# EAGLE design YARO (EAGLE 6.6.0)
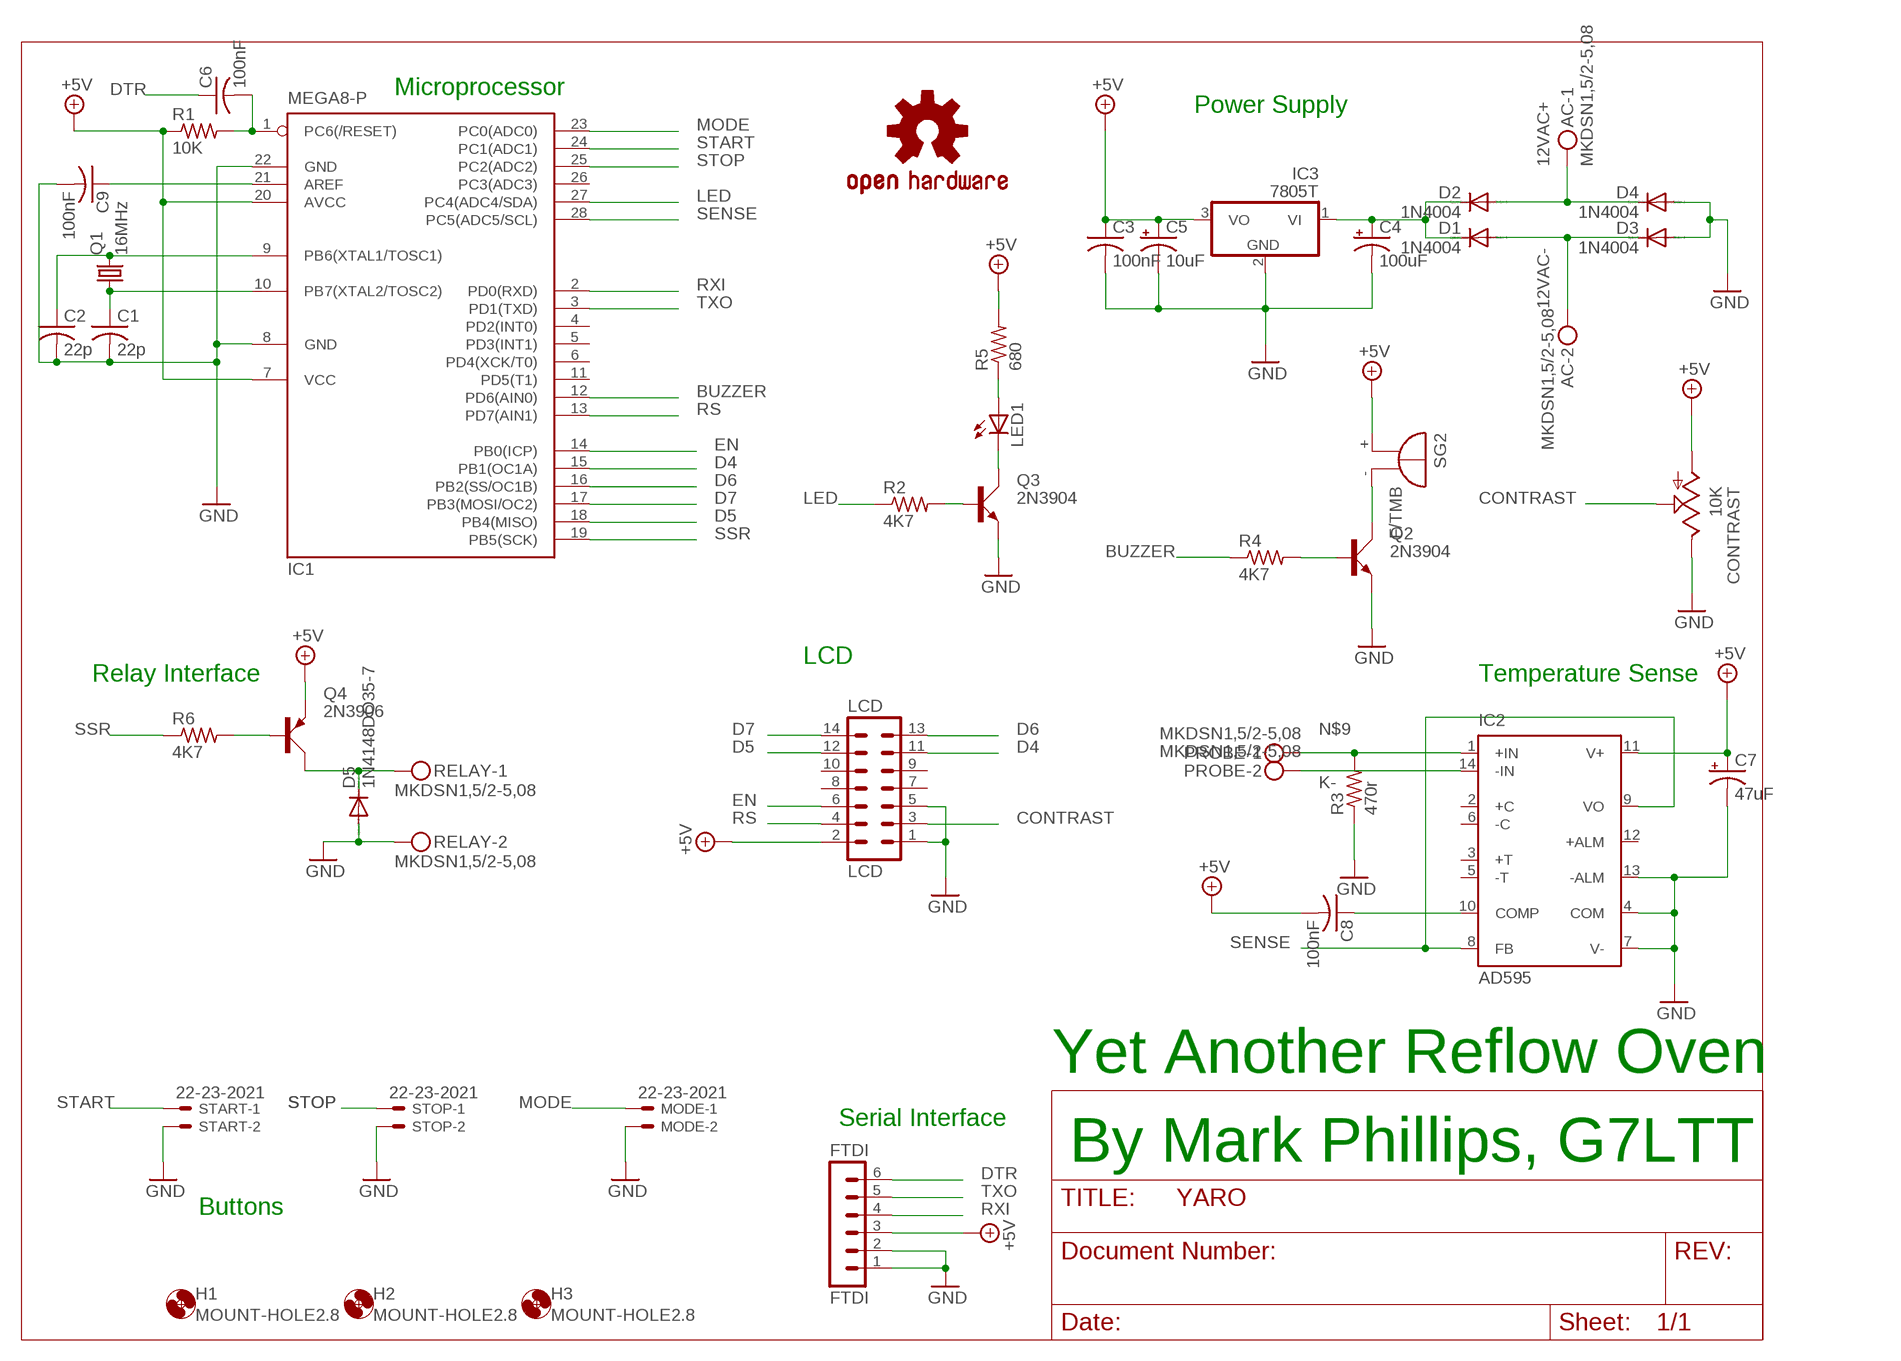
[diagram p0: schematic, sheet 1]

## Parts
AC  MKDSN1,5/2-5,08  [MKDSN1,5/2-5,08]
C1  22p  C-US025-025X050  [C025-025X050]
C2  22p  C-US025-025X050  [C025-025X050]
C3  100nF  C-US025-025X050  [C025-025X050]
C4  100uF  CPOL-USE2.5-6  [E2,5-6]
C5  10uF  CPOL-USE2.5-5  [E2,5-5]
C6  100nF  C-US025-025X050  [C025-025X050]
C7  47uF  CPOL-USE2.5-5  [E2,5-5]
C8  100nF  C-US025-025X050  [C025-025X050]
C9  100nF  C-US025-025X050  [C025-025X050]
CONTRAST  10K  TRIM_US-CA6V  [CA6V]
D1  1N4004  [DO41-10]
D2  1N4004  [DO41-10]
D3  1N4004  [DO41-10]
D4  1N4004  [DO41-10]
D5  1N4148DO35-7  [DO35-7]
FTDI  FTDI  MA06-1  [MA06-1]
H1  MOUNT-HOLE2.8  [2,8]
H2  MOUNT-HOLE2.8  [2,8]
H3  MOUNT-HOLE2.8  [2,8]
IC1  MEGA8-P  [DIL28-3]
IC2  AD595  [DIL14]
IC3  7805T  [TO220H]
LCD  LCD  MA07-2  [MA07-2]
LED1  LED5MM  [LED5MM]
LOGO2  OSHW-LOGOL  [OSHW-LOGO-L]
MODE  22-23-2021  [22-23-2021]
PROBE  MKDSN1,5/2-5,08  [MKDSN1,5/2-5,08]
Q1  16MHz  CRYSTALHC49S  [HC49/S]
Q2  2N3904  [TO92D]
Q3  2N3904  [TO92D]
Q4  2N3906  [TO92D]
R1  10K  R-US_0204/7  [0204/7]
R2  4K7  R-US_0204/7  [0204/7]
R3  470r  R-US_0204/7  [0204/7]
R4  4K7  R-US_0204/7  [0204/7]
R5  680  R-US_0204/7  [0204/7]
R6  4K7  R-US_0204/7  [0204/7]
RELAY  MKDSN1,5/2-5,08  [MKDSN1,5/2-5,08]
SG2  F/TMB  [F/TMB]
START  22-23-2021  [22-23-2021]
STOP  22-23-2021  [22-23-2021]

## Nets
12VAC+: AC.1 D2.A D4.C
12VAC-: AC.2 D1.A D3.C
+5V: C3.1 C5.+ C7.+ C8.2 CONTRAST.A FTDI.3 IC1.7(VCC) IC1.20(AVCC) IC2.11(V+) IC3.3(VO) LCD.2 Q4.E R1.1 R5.2 SG2.+
BUZZER: IC1.12(PD6(AIN0)) R4.1
CONTRAST: CONTRAST.S LCD.3
D4: IC1.15(PB1(OC1A)) LCD.11
D5: IC1.18(PB4(MISO)) LCD.12
D6: IC1.16(PB2(SS/OC1B)) LCD.13
D7: IC1.17(PB3(MOSI/OC2)) LCD.14
DTR: C6.1 FTDI.6
EN: IC1.14(PB0(ICP)) LCD.6
GND: C1.2 C2.2 C3.2 C4.- C5.- C7.- C9.2 CONTRAST.E D3.A D4.A D5.A FTDI.1 FTDI.2 IC1.8(GND) IC1.22(GND) IC2.4(COM) IC2.7(V-) IC2.13(-ALM) IC3.2(GND) LCD.1 LCD.5 MODE.2 Q2.E Q3.E R3.1 RELAY.2 START.2 STOP.2
K-: IC2.14(-IN) PROBE.2
LED: IC1.27(PC4(ADC4/SDA)) R2.1
MODE: IC1.23(PC0(ADC0)) MODE.1
N$1: C2.1 IC1.9(PB6(XTAL1/TOSC1)) Q1.2
N$2: C1.1 IC1.10(PB7(XTAL2/TOSC2)) Q1.1
N$3: C4.+ D1.C D2.C IC3.1(VI)
N$4: C6.2 IC1.1(PC6(/RESET)) R1.2
N$5: Q3.B R2.2
N$6: LED1.K(C) Q3.C
N$7: Q4.B R6.2
N$8: D5.C Q4.C RELAY.1
N$9: IC2.1(+IN) PROBE.1 R3.2
N$10: C9.1 IC1.21(AREF)
N$11: C8.1 IC2.10(COMP)
N$12: Q2.C SG2.-
N$13: Q2.B R4.2
N$18: LED1.A R5.1
RS: IC1.13(PD7(AIN1)) LCD.4
RXI: FTDI.4 IC1.2(PD0(RXD))
SENSE: IC1.28(PC5(ADC5/SCL)) IC2.8(FB) IC2.9(VO)
SSR: IC1.19(PB5(SCK)) R6.1
START: IC1.24(PC1(ADC1)) START.1
STOP: IC1.25(PC2(ADC2)) STOP.1
TXO: FTDI.5 IC1.3(PD1(TXD))
Unconnected: IC1.4(PD2(INT0)) IC1.5(PD3(INT1)) IC1.6(PD4(XCK/T0)) IC1.11(PD5(T1)) IC1.26(PC3(ADC3)) IC2.2(+C) IC2.3(+T) IC2.5(-T) IC2.6(-C) IC2.12(+ALM) LCD.7 LCD.8 LCD.9 LCD.10

## Notes on the sheet
- Microprocessor
- Power Supply
- LCD
- Relay Interface | Temperature Sense
- Yet Another Reflow Oven
- Serial Interface
- By Mark Phillips, G7LTT
- Buttons

## Library data of the parts
AC PROBE RELAY = con-phoenix-508:MKDSN1,5/2-5,08: MKDSN 1,5/ 2-5,08 Printklemme Nennstrom: 13,5 A Nennspannung: 250 V Rastermaß: 5,08 mm Polzahl: 2 Anschlussart: Schraubanschluss Montage: Löten Anschlussrichtung Leiter/Platine: 0 ° Artikelnummer: 1729128 Source: http://eshop.phoenixcontact.com .. 1729128.pdf
C1-C3 C6 C8 C9 = rcl:C-US: CAPACITOR, American symbol
C4 C5 C7 = rcl:CPOL-US: POLARIZED CAPACITOR, American symbol
CONTRAST = pot:TRIM_US-: POTENTIOMETER
D1-D4 = diode:1N4004: DIODE general purpose rectifier, 1 A
D5 = diode:1N4148: DIODE high speed (Philips)
FTDI = con-lstb:MA06-1: PIN HEADER; OC_FARNELL: unknown; OC_NEWARK: unknown
H1-H3 = holes:MOUNT-HOLE: MOUNTING HOLE with drill center marker
IC1 = atmel:MEGA8-P: MICROCONTROLLER 8 Kbytes FLASH, 1 kbytes SRAM, 512 bytes EEPROM, USART, 4-channel 10 bit ADC, 2-channel 8 bit ADC Pin compatible with Atmega48, ATMega88, ATMega168 Source: avr.lbr; OC_FARNELL: unknown; OC_NEWARK: unknown
IC2 = analog-devices:AD595: ANALOG DEVICES; MPN: AD595AQ; OC_FARNELL: 409194; OC_NEWARK: 06WX1596
IC3 = linear:78*: Positive VOLTAGE REGULATOR Source: http://cache.national.com/ds/LM/LM78L05.pdf http://www.fairchildsemi.com/ds/LM/LM7805.pdf
LCD = con-lstb:MA07-2: PIN HEADER; OC_FARNELL: unknown; OC_NEWARK: unknown
LED1 = led:LED: LED OSRAM: - CHIPLED LG R971, LG N971, LY N971, LG Q971, LY Q971, LO R971, LY R971 LH N974, LH R974 LS Q976, LO Q976, LY Q976 LO Q996 - Hyper CHIPLED LW Q18S LB Q993, LB Q99A, LB R99A - SideLED LS A670, LO A670, LY A670, LG A670, LP A670 LB A673, LV A673, LT A673, LW A673 LH A674 LY A675 LS A676, LA A676, LO A676, LY A676, LW A676 LS A679, LY A679, LG A679 - Hyper Micro SIDELED® LS Y876, LA Y876, LO Y876, LY Y876 LT Y87S - SmartLED LW L88C, LW L88S LB L89C, LB L89S, LG L890 LS L89K, LO L89K, LY L89K LS L896, LA L896, LO L896, LY L896 - TOPLED LS T670, LO T670, LY T670, LG T670, LP T670 LSG T670, LSP T670, LSY T670, LOP T670, LYG T670 LG T671, LOG T671, LSG T671 LB T673, LV T673, LT T673, LW T673 LH T674 LS T676, LA T676, LO T676, LY T676, LB T676, LH T676, LSB T676, LW T676 LB T67C, LV T67C, LT T67C, LS T67K, LO T67K, LY T67K, LW E67C LS E67B, LA E67B, LO E67B, LY E67B, LB E67C, LV E67C, LT E67C LW T67C LS T679, LY T679, LG T679 LS T770, LO T770, LY T770, LG T770, LP T770 LB T773, LV T773, LT T773, LW T773 LH T774 LS E675, LA E675, LY E675, LS T675 LS T776, LA T776, LO T776, LY T776, LB T776 LHGB T686 LT T68C, LB T68C - Hyper Mini TOPLED® LB M676 - Mini TOPLED Santana® LG M470 LS M47K, LO M47K, LY M47K Source: http://www.osram.convergy.de LUXEON: - LUMILED® LXK2-PW12-R00, LXK2-PW12-S00, LXK2-PW14-U00, LXK2-PW14-V00 LXK2-PM12-R00, LXK2-PM12-S00, LXK2-PM14-U00 LXK2-PE12-Q00, LXK2-PE12-R00, LXK2-PE12-S00, LXK2-PE14-T00, LXK2-PE14-U00 LXK2-PB12-K00, LXK2-PB12-L00, LXK2-PB12-M00, LXK2-PB14-N00, LXK2-PB14-P00, LXK2-PB14-Q00 LXK2-PR12-L00, LXK2-PR12-M00, LXK2-PR14-Q00, LXK2-PR14-R00 LXK2-PD12-Q00, LXK2-PD12-R00, LXK2-PD12-S00 LXK2-PH12-R00, LXK2-PH12-S00 LXK2-PL12-P00, LXK2-PL12-Q00, LXK2-PL12-R00 Source: www.luxeon.com KINGBRIGHT: KA-3528ASYC Source: www.kingbright.com
LOGO2 = SparkFun-Aesthetics:OSHW-LOGO: Open Source Hardware Logo This logo indicates the piece of hardware it is found on incorporates a OSHW license and/or adheres to the definition of open source hardware found here: http://freedomdefined.org/OSHW
MODE START STOP = con-molex:22-23-2021: .100" (2.54mm) Center Header - 2 Pin; MF: MOLEX; MPN: 22-23-2021; OC_FARNELL: 1462926; OC_NEWARK: 25C3832
Q1 = crystal:CRYSTAL: CRYSTAL; OC_FARNELL: 1667008; OC_NEWARK: unknown
Q2 Q3 = transistor-small-signal:2N3904: NPN TRANSISTOR
Q4 = transistor-small-signal:2N3906: PNP TRANSISTOR
R1-R6 = resistor:R-US_: RESISTOR, American symbol
SG2 = buzzer:F/TMB: BUZZER Source: Buerklin; OC_FARNELL: unknown; OC_NEWARK: unknown

## Board
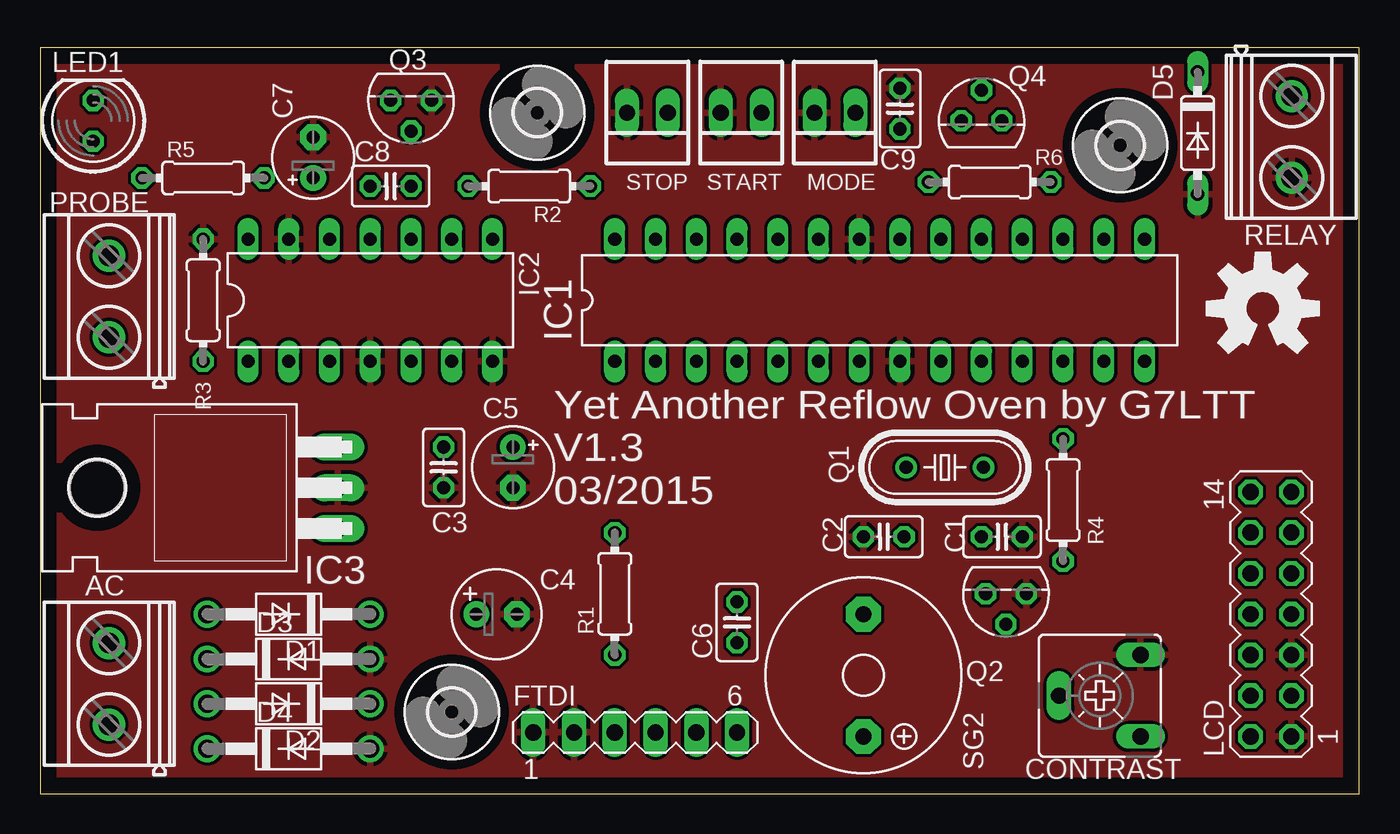
[diagram p1: board, top side]
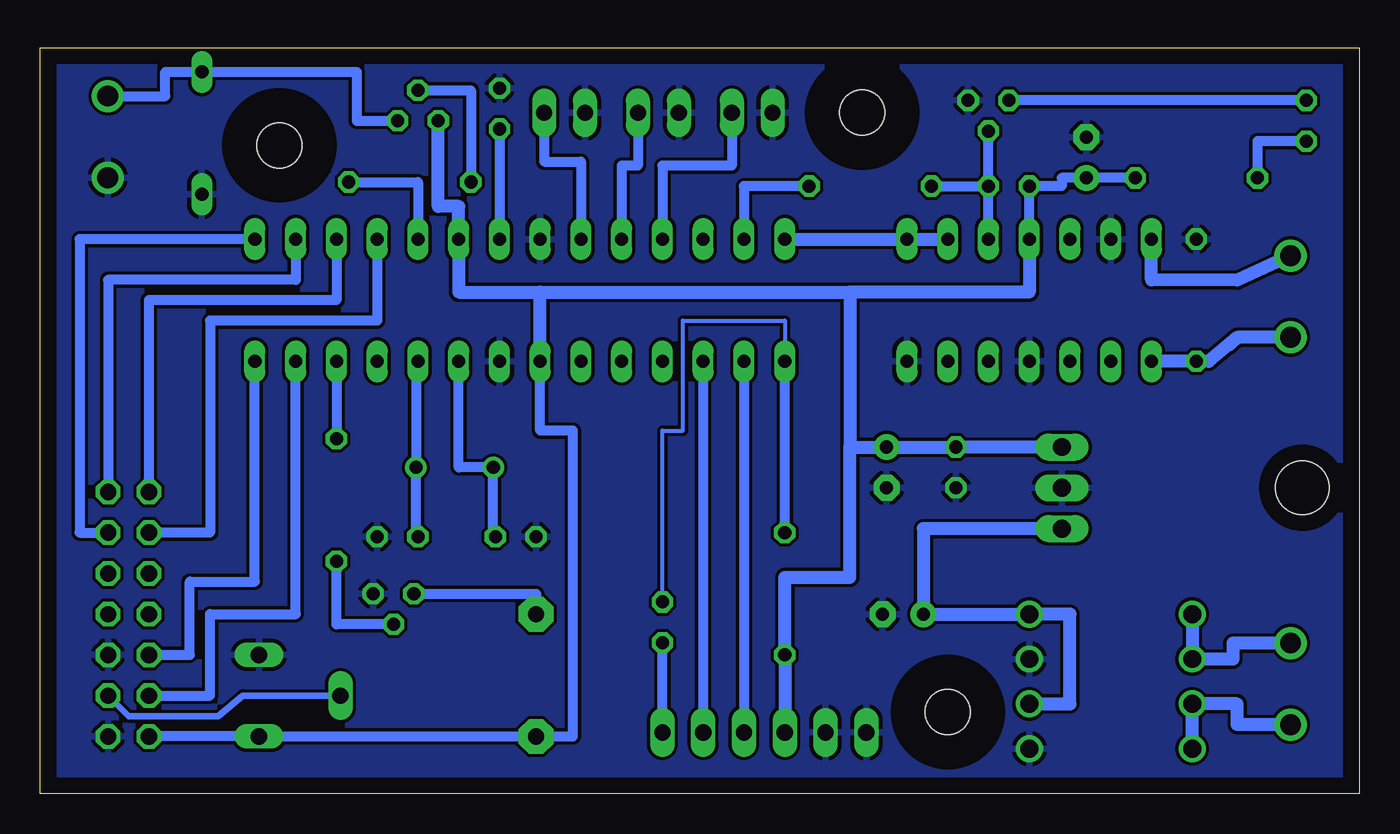
[diagram p2: board, bottom side, seen from below]

Size 82.22 x 46.47 mm. Coordinates in mm from the lower left corner, seen from the top.
Outline: 0,0 82.22,0 82.22,46.47 0,46.47 0,0
Copper layers (1*16): Top 0.035mm / dielectric 1.5mm / Bottom 0.035mm
Design rules "default": minimum track width 10mil, minimum drill 24mil, track to track 8mil, track to pad 8mil, pad to pad 8mil, via to via 8mil, smd to smd 8mil, copper to edge 40mil, drill to drill 8mil, minimum pad ring 10mil, minimum via ring 8mil, stop-mask expansion 4mil, vias tented up to drill 0mil, thermal gap 10mil

### Footprints (pad centres in the part's own frame; a part is rotated, then mirrored left to right if it is on the bottom)
MKDSN1,5/2-5,08 = drill 1.3 pad 2: 1 -2.561,0.025; 2 2.519,0.025
C025-025X050 = drill 0.813 octagon: 1 -1.27,0; 2 1.27,0
E2,5-6 = drill 0.813 pad 1.6: + -1.27,0 | drill 0.813 pad 1.6 octagon: - 1.27,0
E2,5-5 = drill 0.813 pad 1.6: + -1.27,0 | drill 0.813 pad 1.6 octagon: - 1.27,0
CA6V = drill 1.016 long: A -2.54,-2.54; E 2.54,-2.54; S 0,2.54
DO41-10 = drill 1.118: A 5.08,0; C -5.08,0
DO35-7 = drill 0.813 long: A 3.81,0; C -3.81,0
MA06-1 = drill 1.016 long: 1 -6.35,0; 2 -3.81,0; 3 -1.27,0; 4 1.27,0; 5 3.81,0; 6 6.35,0
2,8 = hole 2.8: 0,0
DIL28-3 = drill 0.813 long: 1 -16.51,-3.81; 2 -13.97,-3.81; 3 -11.43,-3.81; 4 -8.89,-3.81; 5 -6.35,-3.81; 6 -3.81,-3.81; 7 -1.27,-3.81; 8 1.27,-3.81; 9 3.81,-3.81; 10 6.35,-3.81; 11 8.89,-3.81; 12 11.43,-3.81; 13 13.97,-3.81; 14 16.51,-3.81; 15 16.51,3.81; 16 13.97,3.81; 17 11.43,3.81; 18 8.89,3.81; 19 6.35,3.81; 20 3.81,3.81; 21 1.27,3.81; 22 -1.27,3.81; 23 -3.81,3.81; 24 -6.35,3.81; 25 -8.89,3.81; 26 -11.43,3.81; 27 -13.97,3.81; 28 -16.51,3.81
DIL14 = drill 0.813 long: 1 -7.62,-3.81; 2 -5.08,-3.81; 3 -2.54,-3.81; 4 0,-3.81; 5 2.54,-3.81; 6 5.08,-3.81; 7 7.62,-3.81; 8 7.62,3.81; 9 5.08,3.81; 10 2.54,3.81; 11 0,3.81; 12 -2.54,3.81; 13 -5.08,3.81; 14 -7.62,3.81
TO220H = drill 1.118 long: 1 -2.54,-10.16; 2 0,-10.16; 3 2.54,-10.16 | hole 3.302: 0,4.826
MA07-2 = drill 1.016 octagon: 1 -7.62,-1.27; 2 -7.62,1.27; 3 -5.08,-1.27; 4 -5.08,1.27; 5 -2.54,-1.27; 6 -2.54,1.27; 7 0,-1.27; 8 0,1.27; 9 2.54,-1.27; 10 2.54,1.27; 11 5.08,-1.27; 12 5.08,1.27; 13 7.62,-1.27; 14 7.62,1.27
LED5MM = drill 0.813 octagon: A -1.27,0; K 1.27,0
22-23-2021 = drill 1 long: 1 -1.27,0; 2 1.27,0
HC49/S = drill 0.813: 1 -2.413,0; 2 2.413,0
TO92D = drill 0.813 octagon: B 0,1.905; C 1.27,0; E -1.27,0
0204/7 = drill 0.813 octagon: 1 -3.81,0; 2 3.81,0
F/TMB = drill 1.016 pad 2.159 octagon: + 3.81,0; - -3.81,0

### Placement (x,y rotation side)
AC  4.32,6.86 90 top
C1  59.94,16 0 top
C2  52.58,16 180 top
C3  25.15,20.32 270 top
C4  28.45,11.18 0 top
C5  29.46,20.32 270 top
C6  43.43,10.67 90 top
C7  17.02,39.62 90 top
C8  21.84,37.85 180 top
C9  53.59,42.67 90 top
CONTRAST  66.04,6.1 90 top
D1  15.49,11.18 180 top
D2  15.49,5.59 180 top
D3  15.49,8.38 0 top
D4  15.49,2.79 0 top
D5  72.14,41.15 270 top
FTDI  37.08,3.81 0 top
H1  30.99,42.42 0 top
H2  25.65,5.08 0 top
H3  67.31,40.39 0 top
IC1  52.32,30.73 0 top
IC2  20.57,30.73 0 top
IC3  8.38,19.05 90 top
LCD  76.71,11.18 90 top
LED1  3.3,41.91 90 top
LOGO2  76.2,30.23 0 top
MODE  49.53,42.42 180 top
PROBE  4.32,30.99 90 top
Q1  56.39,20.32 180 top
Q2  60.2,12.45 180 top
Q3  23.11,43.18 180 top
Q4  58.67,41.91 0 top
R1  35.81,12.45 90 top
R2  30.48,37.85 180 top
R3  10.16,30.73 270 top
R4  63.75,18.29 270 top
R5  10.16,38.35 0 top
R6  59.18,38.1 180 top
RELAY  77.98,40.89 270 top
SG2  51.31,7.37 270 top
START  43.69,42.42 180 top
STOP  37.85,42.42 180 top

### Tracks (layer width: path | path; a pad name or v marks a point on that pad's centre or on a via)
12VAC+
  Bottom 0.813: D4.C D2.A 7.62,5.59 7.62,4.3 AC.1
12VAC-
  Bottom 0.813: D1.A D3.C 7.87,8.38 7.87,9.38 AC.2
+5V
  Bottom 0.61: IC2.11 C8.2 18.54,37.85 18.54,38.35 C7.+ R5.2 | IC1.7 51.05,22.61 49.02,22.61 49.02,3.56 SG2.+ CONTRAST.A LCD.2
  Bottom 0.813: FTDI.3 R1.1 35.81,13.46 31.75,13.46 31.75,21.59 | IC3.3 C3.1 C5.+ 31.75,21.59 | IC2.11 20.57,31.24 31.75,31.24 | 31.75,31.24 31.75,21.59 | 51.05,31.24 56.13,31.24 IC1.20 56.13,36.58 57.4,36.58 Q4.E | 51.05,31.24 31.75,31.24 | IC1.7 51.05,31.24
BUZZER
  Bottom 0.61: IC1.12 R4.1
CONTRAST
  Bottom 0.406: LCD.3 76.71,4.83 71.12,4.83 69.6,6.1 CONTRAST.S
D4
  Bottom 0.61: IC1.15 79.76,34.54 79.76,16.26 LCD.11
D5
  Bottom 0.61: IC1.18 61.21,29.46 71.63,29.46 71.63,16.26 LCD.12
D6
  Bottom 0.61: IC1.16 66.29,32 77.98,32 LCD.13
D7
  Bottom 0.61: IC1.17 63.75,30.73 75.44,30.73 LCD.14
DTR
  Bottom 0.61: FTDI.6 C6.1
EN
  Bottom 0.61: LCD.6 72.9,8.64 72.9,13.21 68.83,13.21 IC1.14
GND
  pour Bottom: 0,0 82.04,0 82.04,46.48 0,46.48
  pour Top: 0,0 82.3,0 82.04,46.48 0,46.48
K-
  Bottom 0.813: PROBE.2 7.62,31.98 12.95,32 IC2.14
LED
  Bottom 0.61: R2.1 38.35,37.85 IC1.27
MODE
  Bottom 0.61: MODE.1 50.8,39.37 48.51,39.37 IC1.23
N$1
  Bottom 0.61: IC1.9 56.13,20.32 Q1.2 53.98,16 C2.1
N$2
  Bottom 0.406: Q1.1 58.67,20.57
  Bottom 0.61: IC1.10 58.8,26.92 Q1.1 58.8,16 C1.1
N$3
  Bottom 0.813: D2.C 18.03,5.59 18.03,11.18 D1.C C4.+ 27.18,16.51 IC3.1
N$4
  Bottom 0.254: C6.2 43.43,22.61 42.16,22.61 42.16,29.46 35.81,29.46 IC1.1
  Bottom 0.61: R1.2 IC1.1
N$5
  Bottom 0.61: R2.2 23.11,37.85 Q3.B
N$6
  Bottom 0.61: LED1.K Q3.C
N$7
  Bottom 0.61: Q4.B 55.37,43.81 R6.2
N$8
  Bottom 0.61: RELAY.1 74.42,43.45 74.42,44.96 D5.C 62.48,44.96 62.48,41.91 Q4.C
N$9
  Bottom 0.813: PROBE.1 7.62,28.43 | 7.62,28.43 8.13,27.94 | 7.62,28.43 9.4,26.92 R3.2 IC2.1
N$10
  Bottom 0.61: C9.1 IC1.21
N$11
  Bottom 0.61: IC2.10 C8.1
N$12
  Bottom 0.61: Q2.C 51.31,12.45 SG2.-
N$13
  Bottom 0.61: Q2.B 63.75,10.54 R4.2
N$18
  Bottom 0.61: LED1.A 6.35,40.64 R5.1
RS
  Bottom 0.61: LCD.4 71.63,6.1 71.63,11.18 66.29,11.18 IC1.13
RXI
  Bottom 0.61: IC1.2 FTDI.4
SENSE
  Bottom 0.813: IC2.9 IC2.8 IC1.28
SSR
  Bottom 0.61: R6.1 58.67,38.1 IC1.19
START
  Bottom 0.61: START.1 44.96,39.12 45.97,39.12 IC1.24
STOP
  Bottom 0.61: STOP.1 39.12,39.12 43.43,39.12 IC1.25
TXO
  Bottom 0.61: IC1.3 FTDI.5

### Text on the board
tPlace: Yet Another Reflow Oven by G7LTT / V1.3 / 03/2015